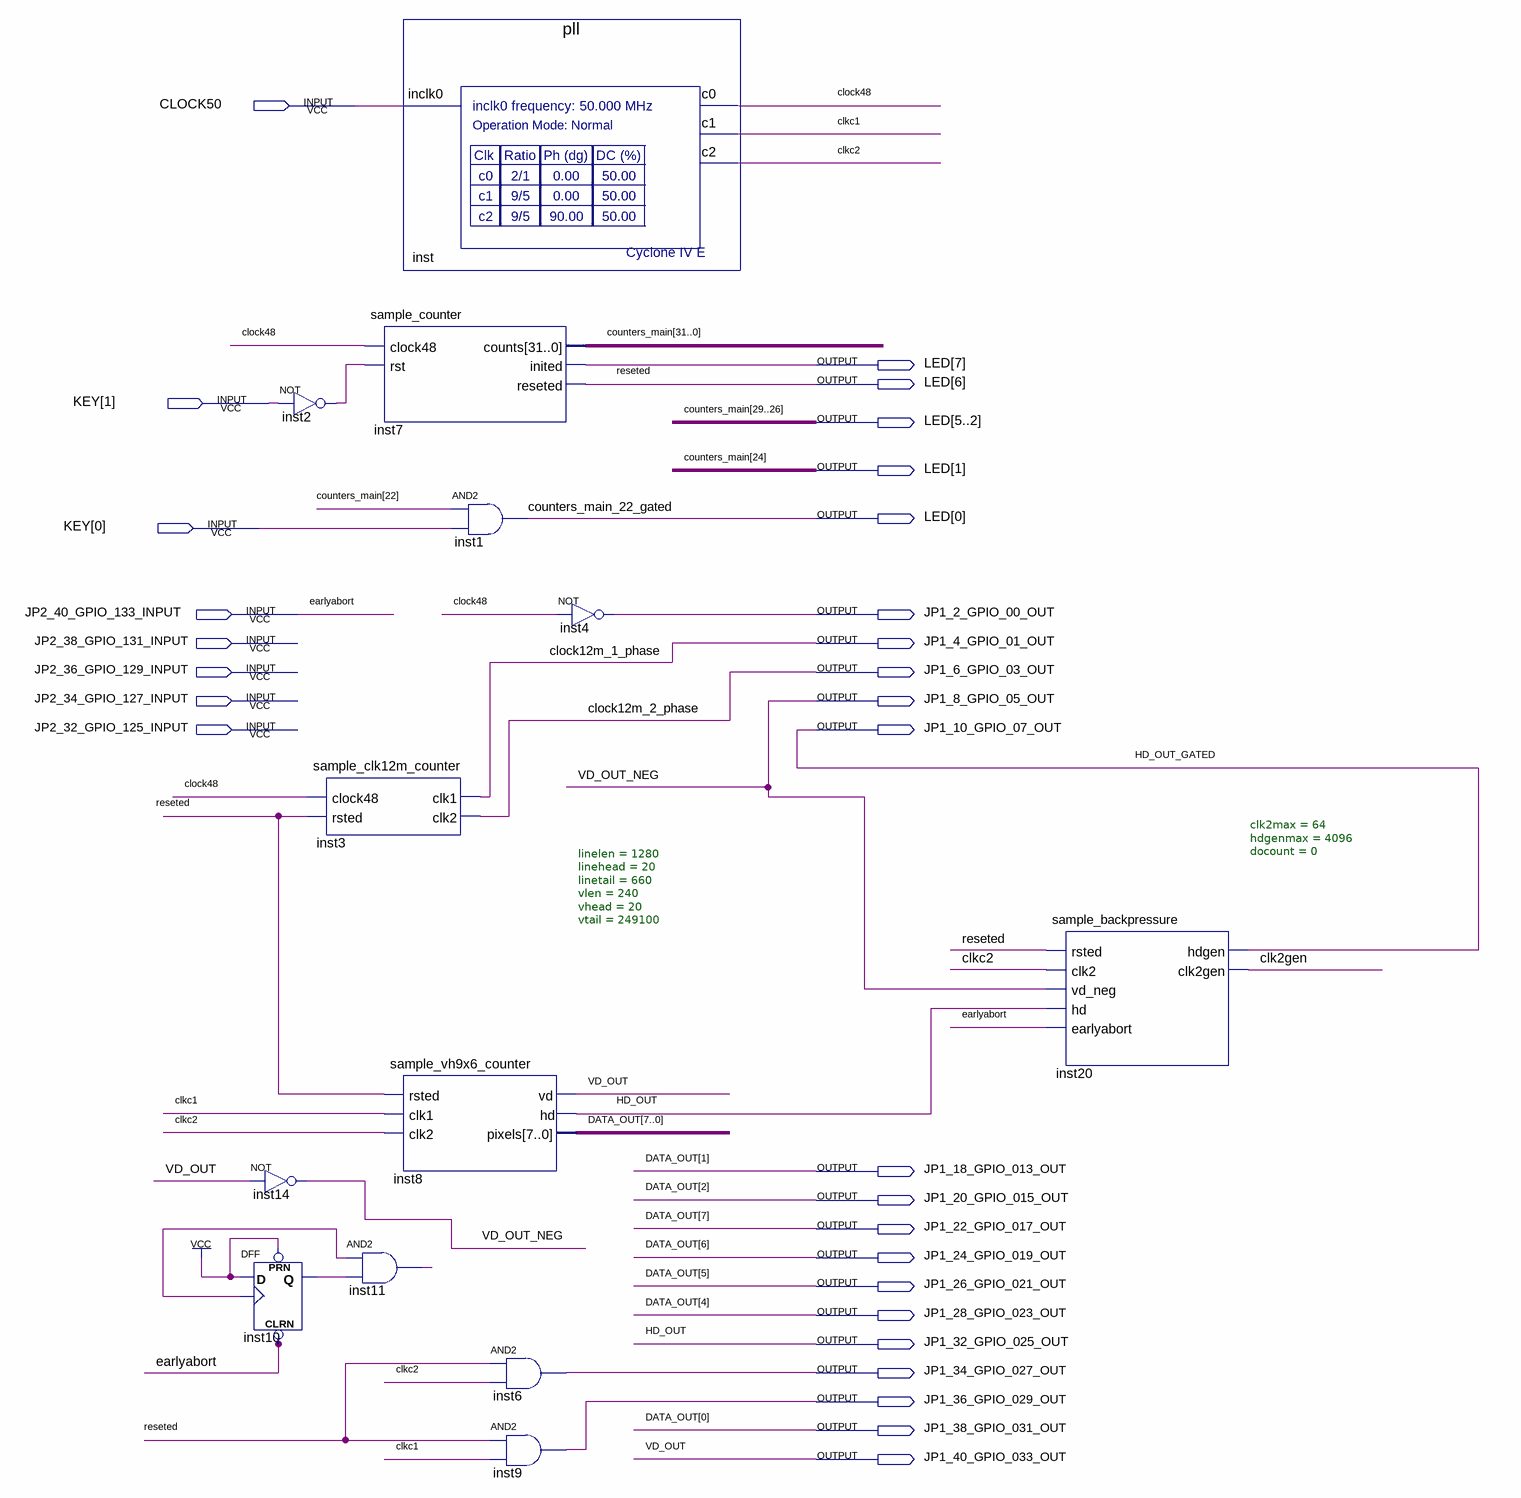
[diagram p0: schematic sheet]
// Quartus schematic fpga_s9_top.bdf as structural Verilog: 13 symbols, 29 pins
module fpga_s9_top (
  input  CLOCK50,
  input  [1:0] KEY,
  input  JP2_40_GPIO_133_INPUT,
  input  JP2_38_GPIO_131_INPUT,
  input  JP2_36_GPIO_129_INPUT,
  input  JP2_34_GPIO_127_INPUT,
  input  JP2_32_GPIO_125_INPUT,
  output [7:0] LED,
  output JP1_2_GPIO_00_OUT,
  output JP1_4_GPIO_01_OUT,
  output JP1_6_GPIO_03_OUT,
  output JP1_8_GPIO_05_OUT,
  output JP1_10_GPIO_07_OUT,
  output JP1_18_GPIO_013_OUT,
  output JP1_20_GPIO_015_OUT,
  output JP1_22_GPIO_017_OUT,
  output JP1_24_GPIO_019_OUT,
  output JP1_26_GPIO_021_OUT,
  output JP1_28_GPIO_023_OUT,
  output JP1_32_GPIO_025_OUT,
  output JP1_34_GPIO_027_OUT,
  output JP1_36_GPIO_029_OUT,
  output JP1_38_GPIO_031_OUT,
  output JP1_40_GPIO_033_OUT
);

  wire clk2gen, clkc1, clkc2, clock48, inst2_out, inst10_q, inst11_out, undriven;
  wire [3:3] DATA_OUT;
  wire [31:0] counters_main;

  not inst2 (inst2_out, KEY[1]);
  not inst14 (JP1_8_GPIO_05_OUT, JP1_40_GPIO_033_OUT);
  DFF inst10 (.CLRN(JP2_40_GPIO_133_INPUT), .CLK(undriven), .D(1'b1), .PRN(1'b1), .Q(inst10_q));
  sample_counter inst7 (
    .clock48(clock48), .rst(inst2_out),
    .counts({counters_main[31:30], LED[5:2], counters_main[25], LED[1], counters_main[23:0]}),
    .inited(LED[7]), .reseted(LED[6]));
  sample_clk12m_counter inst3 (.clock48(clock48), .rsted(LED[6]), .clk1(JP1_4_GPIO_01_OUT), .clk2(JP1_6_GPIO_03_OUT));
  and inst11 (inst11_out, undriven, inst10_q);
  pll inst (.inclk0(CLOCK50), .c0(clock48), .c1(clkc1), .c2(clkc2));
  and inst1 (LED[0], counters_main[22], KEY[0]);
  sample_vh9x6_counter #(.linelen(1280), .linehead(20), .linetail(660), .vlen(240), .vhead(20), .vtail(249100)) inst8 (
    .rsted(LED[6]), .clk1(clkc1), .clk2(clkc2), .vd(JP1_40_GPIO_033_OUT), .hd(JP1_32_GPIO_025_OUT),
    .pixels({JP1_22_GPIO_017_OUT, JP1_24_GPIO_019_OUT, JP1_26_GPIO_021_OUT, JP1_28_GPIO_023_OUT, DATA_OUT[3], JP1_20_GPIO_015_OUT, JP1_18_GPIO_013_OUT, JP1_38_GPIO_031_OUT}));
  and inst6 (JP1_34_GPIO_027_OUT, LED[6], clkc2);
  and inst9 (JP1_36_GPIO_029_OUT, LED[6], clkc1);
  not inst4 (JP1_2_GPIO_00_OUT, clock48);
  sample_backpressure #(.clk2max(64), .hdgenmax(4096), .docount(0)) inst20 (
    .rsted(LED[6]), .clk2(clkc2), .vd_neg(JP1_8_GPIO_05_OUT), .hd(JP1_32_GPIO_025_OUT),
    .earlyabort(JP2_40_GPIO_133_INPUT), .hdgen(JP1_10_GPIO_07_OUT), .clk2gen(clk2gen));

  // Other names for the same wires on the sheet: counters_main (some bits) = LED[5:1];
  //   counters_main_22_gated = LED[0];
  //   DATA_OUT (some bits) = {JP1_22_GPIO_017_OUT, JP1_24_GPIO_019_OUT, JP1_26_GPIO_021_OUT, JP1_28_GPIO_023_OUT, JP1_20_GPIO_015_OUT, JP1_18_GPIO_013_OUT, JP1_38_GPIO_031_OUT};
  //   earlyabort = JP2_40_GPIO_133_INPUT; HD_OUT = JP1_32_GPIO_025_OUT; clock12m_1_phase = JP1_4_GPIO_01_OUT;
  //   clock12m_2_phase = JP1_6_GPIO_03_OUT; HD_OUT_GATED = JP1_10_GPIO_07_OUT; reseted = LED[6];
  //   VD_OUT = JP1_40_GPIO_033_OUT; VD_OUT_NEG = JP1_8_GPIO_05_OUT
endmodule
